# EAGLE board node5-frontend (EAGLE 5.11), part 1 of 2
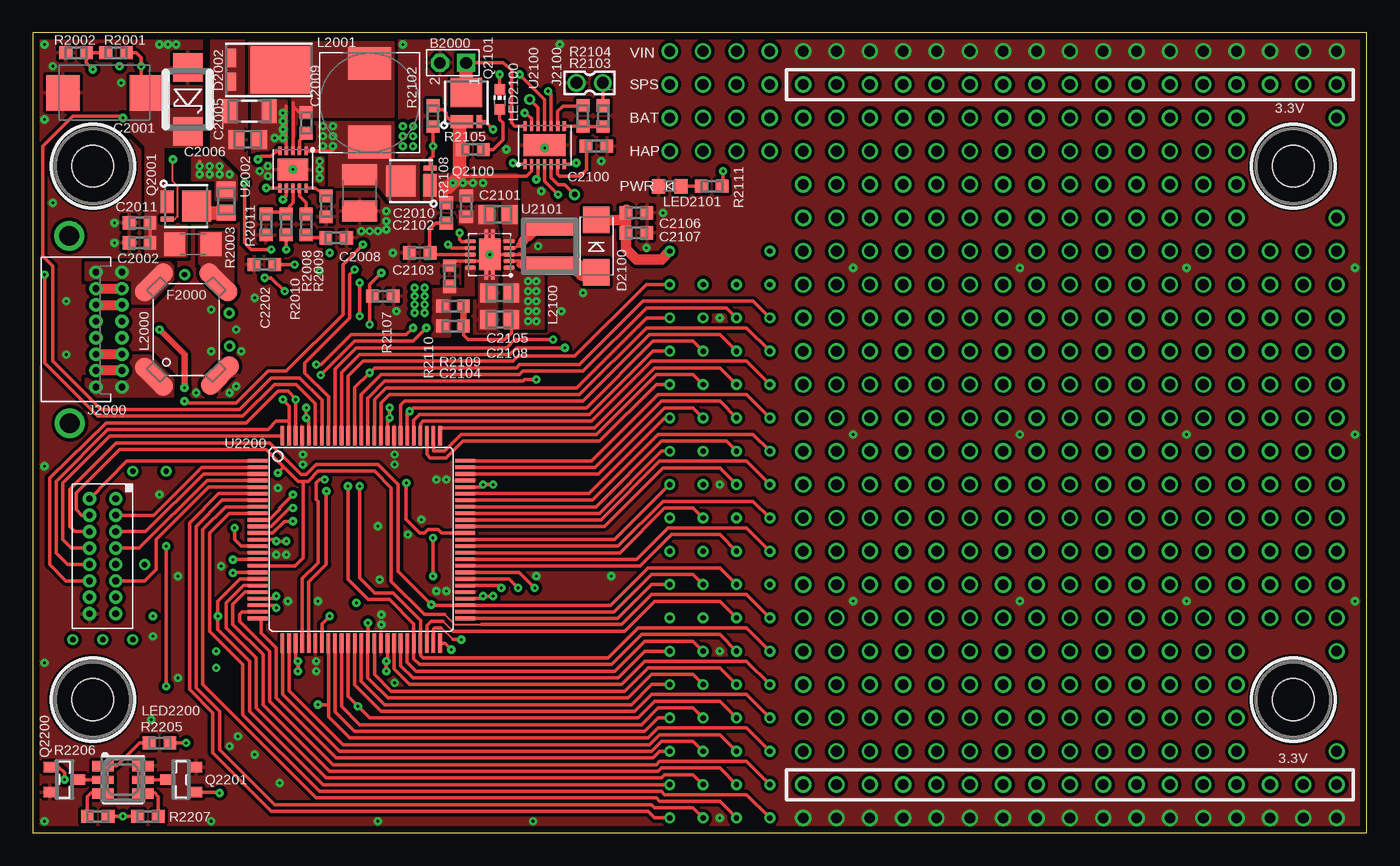
[diagram p2: board, top side]
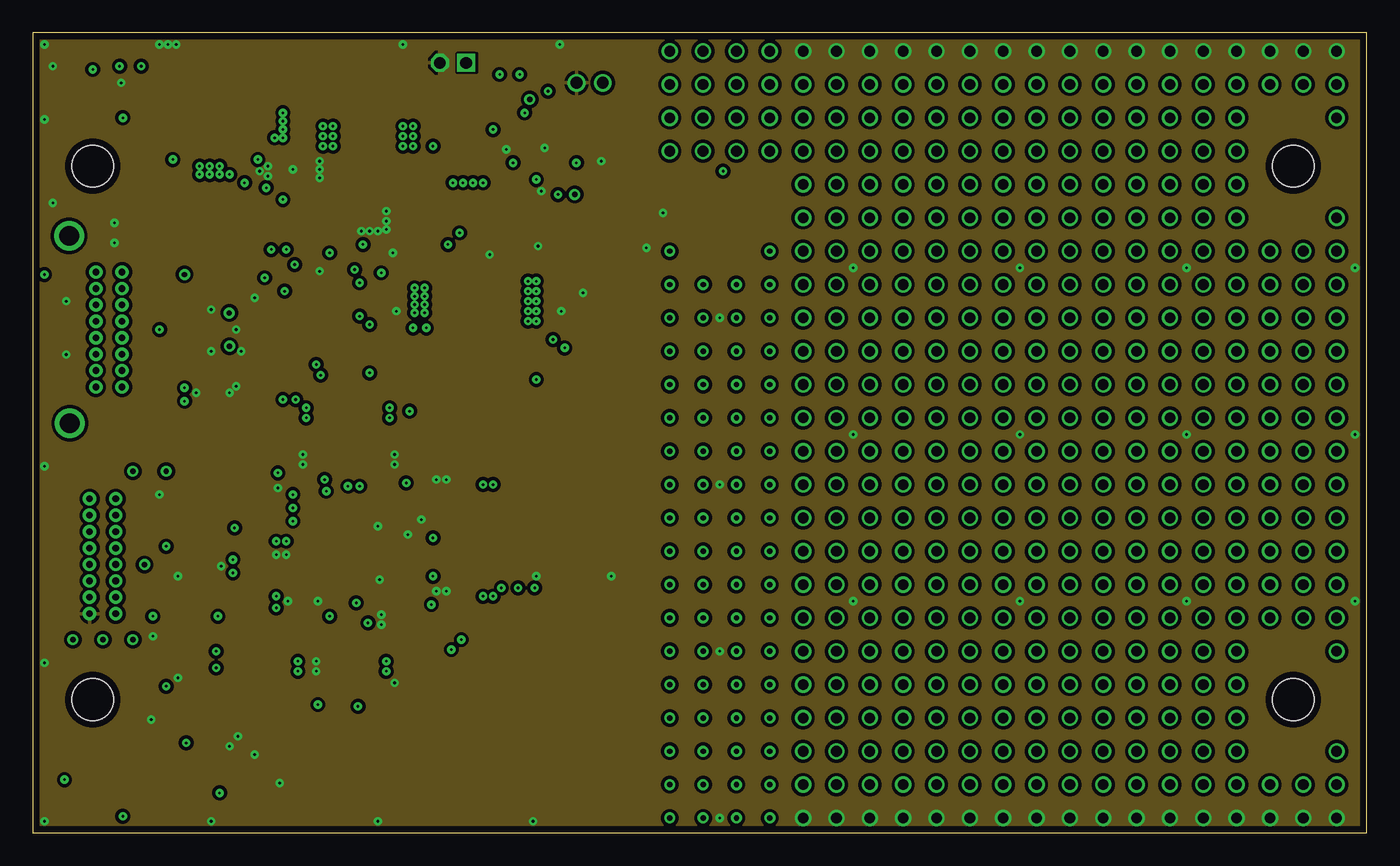
[diagram p3: board, inner layer Route2]
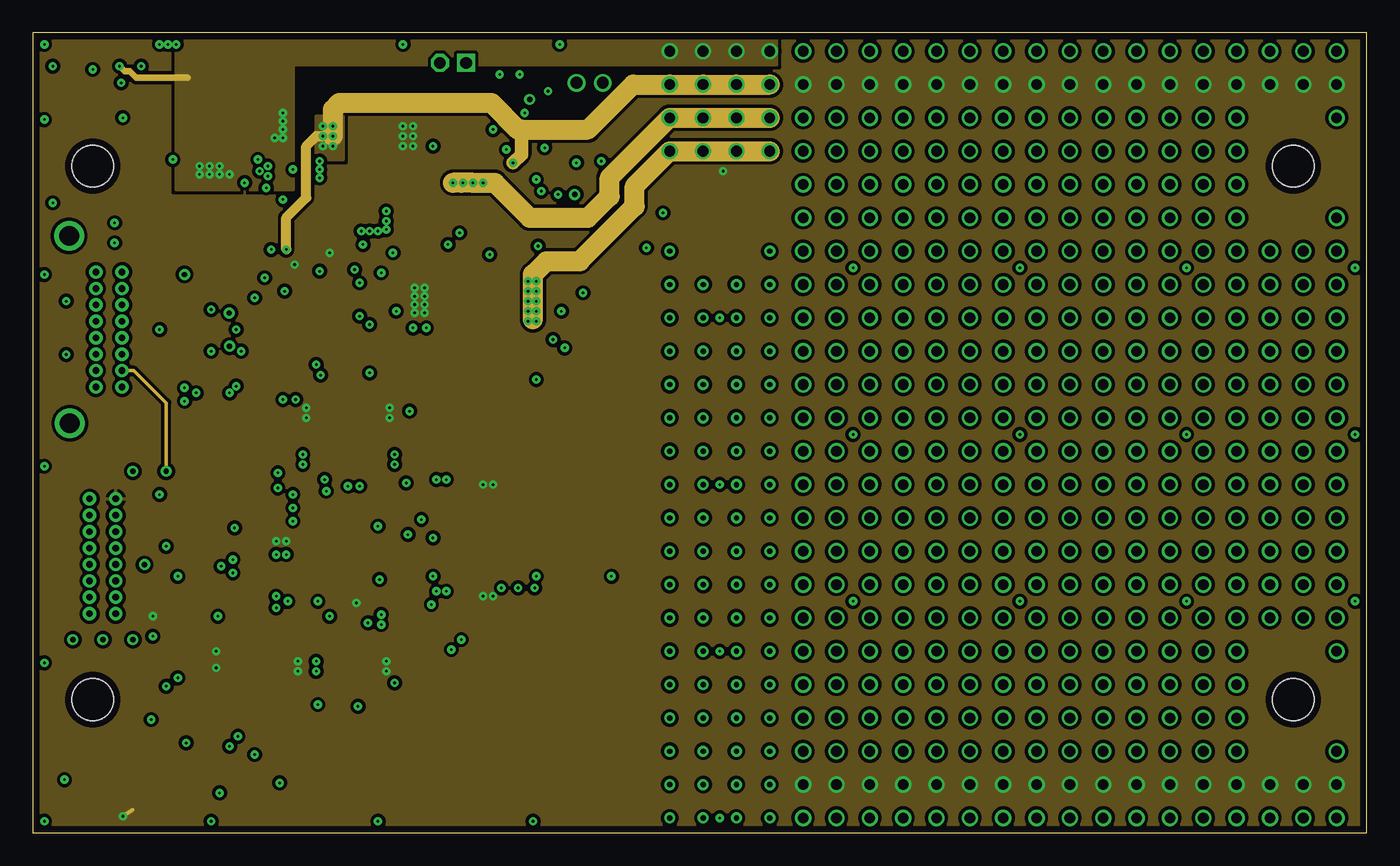
[diagram p4: board, inner layer Route15]
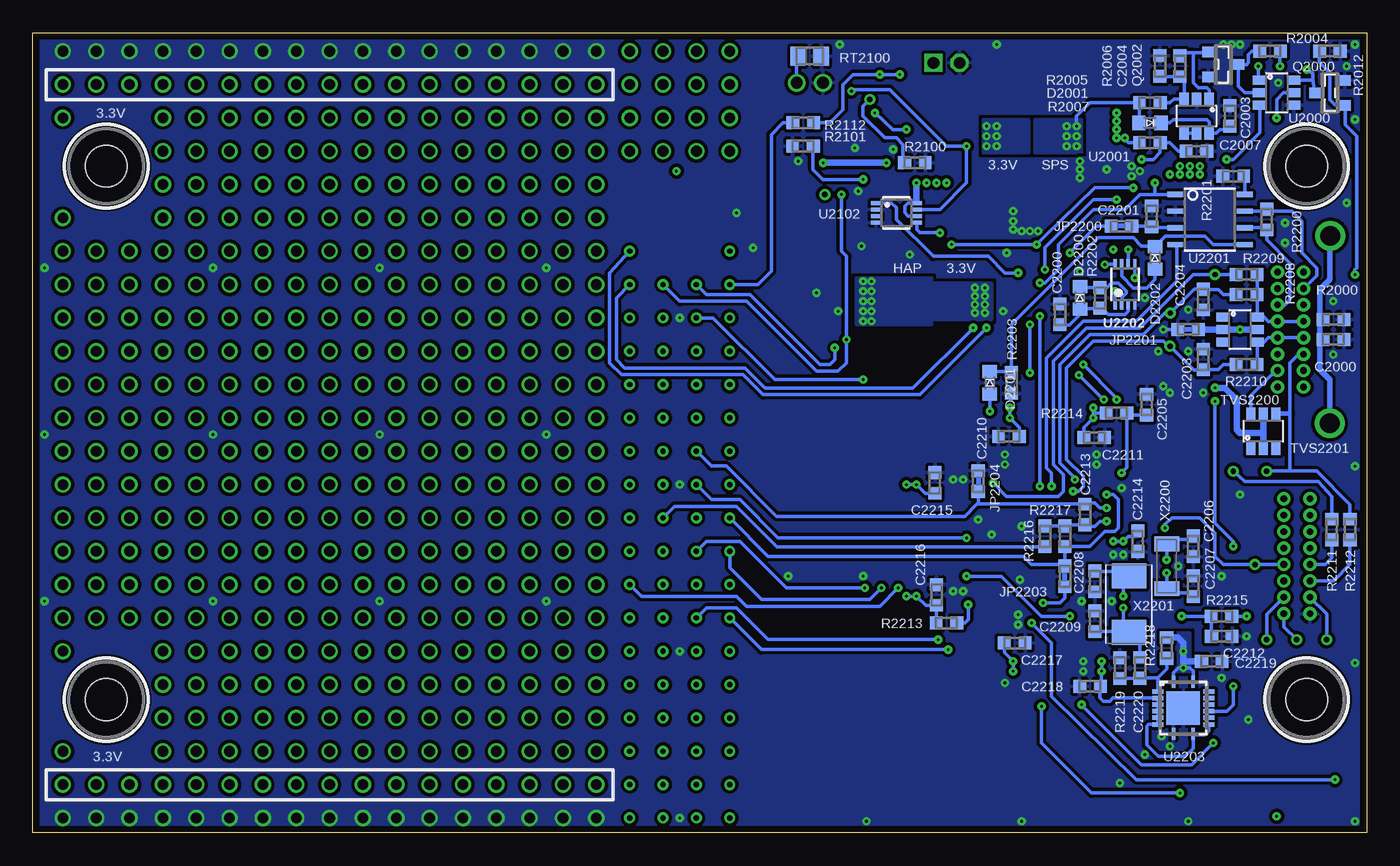
[diagram p5: board, bottom side, seen from below]

Size 101.6 x 60.96 mm. Coordinates in mm from the lower left corner, seen from the top.
Outline: 0,0 101.6,0 101.6,60.96 0,60.96 0,0
Copper layers (1+2*15+16): Top 0.0432mm / dielectric 0.3048mm / Route2 0.0356mm / dielectric 0.7112mm / Route15 0.0356mm / dielectric 0.3023mm / Bottom 0.0432mm
Design rules "sunstone_4lr_rules_v1.3_modifid *": minimum track width 6mil, minimum drill 8mil, track to track 6mil, track to pad 6mil, pad to pad 6mil, via to via 6mil, smd to smd 6mil, copper to edge 20mil, drill to drill 16mil, minimum pad ring 0.2118mm, minimum via ring 0.2118mm, stop-mask expansion 3mil, vias tented up to drill 0mil, thermal gap 10mil
tRestrict: 2 lines

## Footprints (pad centres in the part's own frame; a part is rotated, then mirrored left to right if it is on the bottom)
2MM-1X2-HEADER = drill 0.889 pad 1.372 square: 1 0,-1 | drill 0.889 pad 1.372 octagon: 2 0,1
0603-B-NOSILK = smd 0.95 x 1: 1 -0.8,0; 2 0.8,0
D/7343-31R = smd 2.55 x 2.7: + 3.175,0; - -3.175,0
1206-B = smd 1.15 x 1.8: 1 -1.5,0; 2 1.5,0
0805-B-NOSILK = smd 1.15 x 1.45: 1 -0.9,0; 2 0.9,0
C1210 = smd 1.6 x 2.7: 1 -1.4,0; 2 1.4,0
0603-DIODE = smd 1 x 1.1: A -0.85,0; K 0.85,0
D_POWERDI5 = smd 0.8 x 1.4: ANODE1 -3.47,-0.8; ANODE2 -3.47,1 | smd 4.7 x 3.6: CATHODE 0.4,0.1
NMINIP2-J1 = smd 2 x 2: A 2,0; C -2,0
1206 = smd 1.6 x 1.8: 1 -1.4,0; 2 1.4,0
#4/.250-BARE+STD_WASHER = hole 3.175: 0,0
ROCKETBUS-PLUG = drill 0.508 pad 1.016 round: AUX_1@11 2,-1.875; AUX_1@12 0,-1.875; AUX_2@13 2,-3.125; AUX_2@14 0,-3.125; B+@1 2,4.375; B+@2 0,4.375; B-@15 2,-4.375; B-@16 0,-4.375; CAN_H@3 2,3.125; CAN_H@4 0,3.125; CAN_L@5 2,1.875; CAN_L@6 0,1.875; USB_H@7 2,0.625; USB_H@8 0,0.625; USB_L@9 2,-0.625; USB_L@10 0,-0.625 | drill 1.511 round: CHASSIS@1 -2.032,7.136; CHASSIS@2 -1.982,-7.136
87758-0216 = drill 0.9 pad 1.27 round: 1 0,-1; 2 0,1
JST-16R-JED = drill 0.508 pad 1.016 round: 1 2,4.375; 2 0,4.375; 3 2,3.125; 4 0,3.125; 5 2,1.875; 6 0,1.875; 7 2,0.625; 8 0,0.625; 9 2,-0.625; 10 0,-0.625; 11 2,-1.875; 12 0,-1.875; 13 2,-3.125; 14 0,-3.125; 15 2,-4.375; 16 0,-4.375
0603-B-NO-SILK-JUMPER = smd 0.95 x 1: 1 -0.8,0; 2 0.8,0
CMS1 = smd 3.5 x 1.5 rotated 45: 1 3.608,-2.462; 3 -3.608,2.462 | smd 3.5 x 1.5 rotated 315: 2 3.508,2.562; 4 -3.608,-2.462
L-DR74 = smd 2.5 x 3.25: 1 -3,0; 2 3,0
L_NR4018 = smd 1.2 x 3.7: 1 -1.4,0; 2 1.4,0
CHIP-LED0603 = smd 0.8 x 0.8: A 0,-0.75; C 0,0.75
PLCC-6 = smd 1.65 x 0.8: 1 -1.525,1.05; 3 -1.525,-1.05; 4 1.525,-1.05; 6 1.525,1.05 | smd 1.65 x 0.6: 2 -1.525,0; 5 1.525,0
SOT23 = smd 0.787 x 0.889: 1 -0.953,-1.143; 2 0.953,-1.143; 3 0,1.143
1212-8_POWERPAK = smd 0.99 x 1.725: 1-2-3 -1.45,0.33 | smd 0.99 x 0.405: 4 -1.45,-0.99 | smd 2.24 x 2.39: 5-6-7-8 0.797,0
PAD_ROUND-APC-FREE_0.1/016 = drill 0.406 round: PAD 0,0
DO-214AA/SMB = smd 2.159 x 2.261: ANODE -2.438,0; CATHODE 2.438,0
SOT23-6 = smd 0.7 x 1: 1 -0.95,-1.3; 2 0,-1.3; 3 0.95,-1.3; 4 0.95,1.3; 5 0,1.3; 6 -0.95,1.3
DFN-10 = smd 0.25 x 0.675: BD -1,-1.413; BOOST -0.5,-1.413; FB 0,1.413; PG 0.5,1.413; RT -1,1.413; RUN/SS 1,-1.413; SW 0,-1.413; SYNC 1,1.413; VC -0.5,1.413; VIN 0.5,-1.413 | smd 2.38 x 1.65: GND 0,0
DFN-14 = smd 0.25 x 0.7: 1 -1.5,-1.45; 2 -1,-1.45; 3 -0.5,-1.45; 4 0,-1.45; 5 0.5,-1.45; 6 1,-1.45; 7 1.5,-1.45; 8 1.5,1.45; 9 1,1.45; 10 0.5,1.45; 11 0,1.45; 12 -0.5,1.45; 13 -1,1.45; 14 -1.5,1.45 | smd 3.3 x 1.7: PGND 0,0
SON-10 = smd 0.28 x 0.85: EN 1,1.475; FB -1,1.475; GND -0.5,1.475; L1 0.5,-1.475; L2 -0.5,-1.475; PGND 0,-1.475; PS/SYNC 0.5,1.475; VIN 1,-1.475; VINA 0,1.475; VOUT -1,-1.475 | smd 2.4 x 1.65: PGND@1 0,0 | smd 3.8 x 0.28: PGND@2 0,0.25; PGND@3 0,-0.25
VSSOP-8 = smd 0.3 x 0.8: 1 -0.75,-1.55; 2 -0.25,-1.55; 3 0.25,-1.55; 4 0.75,-1.55; 5 0.75,1.55; 6 0.25,1.55; 7 -0.25,1.55; 8 -0.75,1.55
LQFP100 = smd 0.28 x 1.5: #RESET 2,-7.9; #RSTOUT 0.5,-7.9; #TRST -4.5,-7.9; P0[15]/TXD1/SCK0/SCK 0.5,7.9; P0[16]/RXD1/SSEL0/SSEL 0,7.9; P0[17]/CTS1/MISO0/MISO 1,7.9; P0[18]/DCD1/MOSI0/MOSI 1.5,7.9; P0[19]/DSR1/MCICLK/SDA1 2,7.9; P0[20]/DTR1/MCICMD/SCL1 2.5,7.9; P0[21]/RI1/MCIPWR/RD1 3,7.9; P0[22]/RTS1/MCIDAT0/TD1 3.5,7.9; P0[23]/AD0[0]/I2SRX_CLK/CAP3[0] -2,-7.9; P0[24]/AD0[1]/I2SRX_WS/CAP3[1] -2.5,-7.9; P0[25]/AD0[2]/I2SRX_SDA/TXD3 -3,-7.9; P0[26]/AD0[3]/AOUT/RXD3 -3.5,-7.9; P0[27]/SDA0 6,-7.9; P0[28]/SCL0 5.5,-7.9; P1[30]/VBUS/AD0[4] 4,-7.9; P1[31]/SCK1/AD0[5] 3.5,-7.9; P2[0]/PWM1[1]/TXD1/TRACECLK -6,7.9; P2[1]/PWM1[2]/RXD1/PIPESTAT0 -5.5,7.9; P2[2]/PWM1[3]/CTS1/PIPESTAT1 -5,7.9; P2[3]/PWM1[4]/DCD1/PIPESTAT2 -3.5,7.9; P2[4]/PWM1[5]/DSR1/TRACESYNC -3,7.9; P2[5]/PWM1[6]/DTR1/TRACEPKT0 -2.5,7.9; P2[6]/PCAP1[0]/RI1/TRACEPKT1 -2,7.9; P2[7]/RD2/RTS1/TRACEPKT2 -1.5,7.9; P2[8]/TD2/TXD2/TRACEPKT3 -1,7.9; P2[9]/USB_CONNECT/RXD2/EXTIN0 -0.5,7.9; P2[10]/#EINT0 5,7.9; P2[11]/#EINT1/MCIDAT1/I2STX_CLK 5.5,7.9; P2[12]/#EINT2/MCIDAT2/I2STX_WS 6,7.9; RTCX1 1.5,-7.9; RTCX2 2.5,-7.9; TCK -4,-7.9; TDI -5.5,-7.9; TDO -6,-7.9; TMS -5,-7.9; VBAT 3,-7.9; VDD(3V3)@1 4.5,7.9; VDD(3V3)@2 -4,7.9; VDD(DCDC)(3V3) 0,-7.9; VDDA -1.5,-7.9; VREF -0.5,-7.9; VSS 1,-7.9; VSS@3 4,7.9; VSS@4 -4.5,7.9; VSSA -1,-7.9; XTAL1 4.5,-7.9; XTAL2 5,-7.9 | smd 1.5 x 0.28: P0[0]/RD1/TXD3/SDA1 7.9,4; P0[1]/TD1/RXD3/SCL1 7.9,4.5; P0[2]/TXD0 -7.9,-5; P0[3]/RXD0 -7.9,-5.5; P0[4]/I2SRX_CLK/RD2/CAP2[0] -7.9,3.5; P0[5]/I2SRX_WS/TD2/CAP2[1] -7.9,4; P0[6]/I2SRX_SDA/SSEL1/MAT2[0] -7.9,4.5; P0[7]/I2STX_CLK/SCK1/MAT2[1] -7.9,5; P0[8]/I2STX_WS/MISO1/MAT2[2] -7.9,5.5; P0[9]/I2STX_SDA/MOSI1/MAT2[3] -7.9,6; P0[10]/TXD2/SDA2/MAT3[0] 7.9,5; P0[11]/RXD2/SCL2/MAT3[1] 7.9,5.5; P0[29]/USB_D+ 7.9,-4.5; P0[30]/USB_D- 7.9,-4; P1[0]/ENET_TXD0 -7.9,-3.5; P1[1]/ENET_TXD1 -7.9,-3; P1[4]/ENET_TX_EN -7.9,-2.5; P1[8]/ENET_CRS -7.9,-2; P1[9]/ENET_RXD0 -7.9,-1.5; P1[10]/ENET_RXD1 -7.9,-1; P1[14]/ENET_RX_ER -7.9,-0.5; P1[15]/ENET_REF_CLK -7.9,0; P1[16]/ENET_MDC -7.9,0.5; P1[17]/ENET_MDIO -7.9,1; P1[18]/USB_UP_LED/PWM1[1]/CAP1[0] 7.9,-3; P1[19]/CAP1[1] 7.9,-2.5; P1[20]/PWM1[2]/SCK0 7.9,-2; P1[21]/PWM1[3]/SSEL0 7.9,-1.5; P1[22]MAT1[0] 7.9,-1; P1[23]/PWM1[4]/MISO0 7.9,-0.5; P1[24]/PWM1[5]/MOSI0 7.9,0; P1[25]/MAT1[1] 7.9,0.5; P1[26]/PWM1[6]/CAP0[0] 7.9,1; P1[27]/CAP0[1] 7.9,2.5; P1[28]/PCAP1[0]/MAT0[0] 7.9,3; P1[29]/PCAP1[1]/MAT0[1] 7.9,3.5; P2[13]/#EINT3/MCIDAT3/I2STX_SDA 7.9,6; P3[25]/MAT0[0]/PWM1[2] 7.9,-5.5; P3[26]/MAT0[1]/PWM1[3] 7.9,-6; P4[28]/MAT2[0]/TXD3 -7.9,3; P4[29]/MAT2[1]/RXD3 -7.9,1.5; RTCK -7.9,-6; VDD(3V3) 7.9,-5; VDD(3V3)@3 -7.9,-4; VDD(DCDC)(3V3)@1 7.9,2; VDD(DCDC)(3V3)@2 -7.9,2; VSS@1 7.9,-3.5; VSS@2 7.9,1.5; VSS@5 -7.9,-4.5; VSS@6 -7.9,2.5
DR-PDSO-G8 = smd 0.4 x 1.2: 1 -1.905,-2.65; 2 -0.635,-2.65; 3 0.635,-2.65; 4 1.905,-2.65; 5 1.905,2.65; 6 0.635,2.65; 7 -0.635,2.65; 8 -1.905,2.65
DCU = smd 0.25 x 0.75: 1 -0.75,-1.55; 2 -0.25,-1.55; 3 0.25,-1.55; 4 0.75,-1.55; 5 0.75,1.55; 6 0.25,1.55; 7 -0.25,1.55; 8 -0.75,1.55
QFN-16 = smd 0.85 x 0.28: 1 -1.97,-0.75; 8 1.97,-0.74; 9 1.97,0.75; 16 -1.98,0.75 | smd 0.28 x 0.85: 2 -1.25,-1.95; 3 -0.75,-1.95; 4 -0.25,-1.95; 5 0.25,-1.95; 6 0.75,-1.95; 7 1.25,-1.95; 10 1.25,1.95; 11 0.75,1.95; 12 0.25,1.95; 13 -0.25,1.95; 14 -0.75,1.95; 15 -1.25,1.95 | smd 2.55 x 2.55: PGND 0,0
CM415 = smd 1.118 x 1.905: P$1 -1.702,0; P$2 1.702,0
CS10 = smd 1.9 x 2.6: P$1 -2.15,0; P$2 2.15,0

## Placement (x,y rotation side)
B2100  BATTERY_SINGLE_CELL_2MM  [2MM-1X2-HEADER]  32,58.67 90 top
C2000  100n 50V  [0603-B-NOSILK]  2.54,37.59 0 bottom
C2001  22u 50V  [D/7343-31R]  5.46,56.39 0 top
C2002  330n 50V  [0603-B-NOSILK]  8.13,44.96 0 top
C2003  2.7u  [0603-B-NOSILK]  10.41,54.61 270 bottom
C2004  15n  [0603-B-NOSILK]  14.22,58.42 90 bottom
C2005  10u 50V  [1206-B]  16.51,54.99 180 top
C2006  1u 50V  [0805-B-NOSILK]  16.38,52.83 180 top
C2007  100n  [0603-B-NOSILK]  12.95,51.94 180 bottom
C2008  680p  [0603-B-NOSILK]  23.11,45.34 180 top
C2009  220n  [0603-B-NOSILK]  20.83,54.1 90 top
C2010  22u  [C1210]  24.89,48.77 270 top
C2011  10n 50V  [0603-B-NOSILK]  8.13,46.48 0 top
C2100  66n  [0603-B-NOSILK]  42.93,52.32 180 top
C2101  10u  [0805-B-NOSILK]  35.43,47.12 0 top
C2102  100n  [0603-B-NOSILK]  33.02,47.75 90 top
C2103  100n  [0603-B-NOSILK]  29.46,44.2 0 top
C2104  2pF  [0603-B-NOSILK]  32,38.61 0 top
C2105  10u  [0805-B-NOSILK]  35.56,41.15 0 top
C2106  TBD  [0603-B-NOSILK]  45.97,47.24 180 top
C2107  TBD  [0603-B-NOSILK]  45.97,45.72 180 top
C2108  10u  [0805-B-NOSILK]  35.56,39.12 0 top
C2200  10n  [0603-B-NOSILK]  23.37,39.5 270 bottom
C2201  100n  [0603-B-NOSILK]  16.38,46.99 90 bottom
C2202  100n  [0603-B-NOSILK]  17.65,43.31 180 top
C2203  18p  [0603-B-NOSILK]  12.45,36.07 270 bottom
C2204  18p  [0603-B-NOSILK]  12.45,40.64 90 bottom
C2205  100n  [0603-B-NOSILK]  16.76,32.64 90 bottom
C2206  22p  [0603-B-NOSILK]  13.21,21.84 90 bottom
C2207  22p  [0603-B-NOSILK]  13.21,18.8 270 bottom
C2208  39p  [0603-B-NOSILK]  20.7,19.18 90 bottom
C2209  33p  [0603-B-NOSILK]  20.7,16.13 270 bottom
C2210  100n  [0603-B-NOSILK]  27.24,30.21 180 bottom
C2211  100n  [0603-B-NOSILK]  20.76,30.12 0 bottom
C2212  100n  [0603-B-NOSILK]  11.05,14.99 0 bottom
C2213  100n  [0603-B-NOSILK]  21.46,24.26 270 bottom
C2214  100n  [0603-B-NOSILK]  17.43,22.23 270 bottom
C2215  100n  [0603-B-NOSILK]  32.89,26.67 90 bottom
C2216  100n  [0603-B-NOSILK]  32.77,18.14 90 bottom
C2217  100n  [0603-B-NOSILK]  26.8,14.48 180 bottom
C2218  100n  [0603-B-NOSILK]  21.08,11.18 0 bottom
C2219  100n  [0603-B-NOSILK]  11.81,13.08 0 bottom
C2220  100p  [0603-B-NOSILK]  17.27,12.57 270 bottom
D2001  CDSU101A  [0603-DIODE]  16.51,54.1 0 bottom
D2002  PDS340  [D_POWERDI5]  18.54,58.04 0 top
D2100  MA2Q705  [NMINIP2-J1]  42.93,44.7 270 top
D2200  CDSU101A  [0603-DIODE]  21.84,40.77 90 bottom
D2201  CDSU101A  [0603-DIODE]  28.7,34.29 90 bottom
D2202  CDSU101A  [0603-DIODE]  16.13,43.81 90 bottom
F2000  2.0A Fast  [1206]  12.19,44.83 180 top
FST2000  #4-BARE_MOUNTING_HOLE/.250  [#4/.250-BARE+STD_WASHER]  4.57,50.8 0 top
FT2001  #4-BARE_MOUNTING_HOLE/.250  [#4/.250-BARE+STD_WASHER]  4.57,10.16 0 top
FT2002  #4-BARE_MOUNTING_HOLE/.250  [#4/.250-BARE+STD_WASHER]  96.01,10.16 0 top
FT2003  #4-BARE_MOUNTING_HOLE/.250  [#4/.250-BARE+STD_WASHER]  96.01,50.8 0 top
J2000  ROCKETBUS-PLUG  [ROCKETBUS-PLUG]  4.8,38.35 0 top
J2100  87758-0216  [87758-0216]  42.42,57.15 90 top
J2204  DEBUG-CONNECTOR  [JST-16R-JED]  4.32,21.08 0 top
JP2200  0603-B-NO-SILK-CUT-JUMPER  [0603-B-NO-SILK-JUMPER]  18.67,46.23 180 bottom
JP2201  0603-B-NO-SILK-CUT-JUMPER  [0603-B-NO-SILK-JUMPER]  13.59,38.35 180 bottom
JP2203  0603-B-NO-SILK-CUT-JUMPER  [0603-B-NO-SILK-JUMPER]  22.99,19.56 90 bottom
JP2204  0603-B-NO-SILK-CUT-JUMPER  [0603-B-NO-SILK-JUMPER]  29.59,26.8 270 bottom
L2000  CMS1  [CMS1]  11.68,38.35 270 top
L2001  L_DR74-6R8-R  [L-DR74]  25.65,55.63 270 top
L2100  2.2 uH L_NR4018T2R2M  [L_NR4018]  39.37,44.7 270 top
LED2100  RED  [CHIP-LED0603]  35.56,55.88 0 top
LED2101  LED-GRN-  [0603-DIODE]  48.51,49.28 180 top
LED2200  [PLCC-6]  6.86,4.06 0 top
Q2000  PMV45EN  [SOT23]  2.79,56.39 90 bottom
Q2001  Si7309DN  [1212-8_POWERPAK]  11.68,47.75 0 top
Q2002  PMV45EN  [SOT23]  10.92,58.55 270 bottom
Q2100  SI7123DN  [1212-8_POWERPAK]  28.83,49.66 180 top
Q2101  SI7123DN  [1212-8_POWERPAK]  33.02,55.63 90 top
Q2200  PMV45EN  [SOT23]  2.41,4.06 270 top
Q2201  PMV45EN  [SOT23]  11.3,4.06 90 top
R2000  100k  [0603-B-NOSILK]  2.54,39.12 0 bottom
R2001  61.9k  [0603-B-NOSILK]  6.35,59.44 0 top
R2002  10k  [0603-B-NOSILK]  3.3,59.44 0 top
R2003  .033  [0805-B-NOSILK]  14.73,48.13 90 top
R2004  1k  [0603-B-NOSILK]  7.37,59.56 0 bottom
R2005  34.0k 1%  [0603-B-NOSILK]  16.51,55.63 180 bottom
R2006  10k 1%  [0603-B-NOSILK]  15.75,58.42 270 bottom
R2007  500k  [0603-B-NOSILK]  16.51,52.58 180 bottom
R2008  15k  [0603-B-NOSILK]  20.83,46.35 90 top
R2009  26.7k  [0603-B-NOSILK]  22.35,47.75 90 top
R2010  532k  [0603-B-NOSILK]  19.3,46.35 270 top
R2011  100k  [0603-B-NOSILK]  17.78,46.35 90 top
R2012  10k  [0603-B-NOSILK]  2.79,59.56 180 bottom
R2100  100k  [0603-B-NOSILK]  34.42,51.05 0 bottom
R2101  660  [0603-B-NOSILK]  42.93,52.32 180 bottom
R2102  1k  [0603-B-NOSILK]  30.48,54.61 90 top
R2103  121k 1%  [0603-B-NOSILK]  41.91,54.61 270 top
R2104  15k 1%  [0603-B-NOSILK]  43.43,54.61 90 top
R2105  1.6k  [0603-B-NOSILK]  33.53,52.07 0 top
R2107  1k  [0603-B-NOSILK]  26.67,40.89 180 top
R2108  100  [0603-B-NOSILK]  31.5,47.24 90 top
R2109  1.0M  [0603-B-NOSILK]  32,40.13 0 top
R2110  178k  [0603-B-NOSILK]  31.75,42.42 270 top
R2111  1k  [0603-B-NOSILK]  51.71,49.28 0 top
R2112  10k  [0603-B-NOSILK]  42.93,54.1 0 bottom
R2200  NP  [0603-B-NOSILK]  7.62,46.74 90 bottom
R2201  18k  [0603-B-NOSILK]  10.16,50.04 0 bottom
R2202  10k  [0603-B-NOSILK]  20.32,40.77 90 bottom
R2203  10k  [0603-B-NOSILK]  27.05,34.29 90 bottom
R2205  1k  [0603-B-NOSILK]  9.65,6.86 0 top
R2206  1k  [0603-B-NOSILK]  4.95,1.27 180 top
R2207  1k  [0603-B-NOSILK]  8.76,1.27 0 top
R2208  1.5k  [0603-B-NOSILK]  9.14,42.55 180 bottom
R2209  33.2  [0603-B-NOSILK]  9.14,41.02 180 bottom
R2210  33.2  [0603-B-NOSILK]  9.14,35.69 180 bottom
R2211  100  [0603-B-NOSILK]  2.67,23.11 270 bottom
R2212  100  [0603-B-NOSILK]  1.27,23.11 270 bottom
R2213  10k  [0603-B-NOSILK]  32,16 180 bottom
R2214  10k  [0603-B-NOSILK]  19.05,32 180 bottom
R2215  0  [0603-B-NOSILK]  11.05,16.51 180 bottom
R2216  0  [0603-B-NOSILK]  24.51,22.61 90 bottom
R2217  0  [0603-B-NOSILK]  22.99,22.61 90 bottom
R2218  100k  [0603-B-NOSILK]  15.24,14.1 270 bottom
R2219  100k  [0603-B-NOSILK]  18.8,12.57 90 bottom
RT2100  100k @25C  [0805-B-NOSILK]  42.42,59.18 0 bottom
TP0.0  PAD_ROUND016  [PAD_ROUND-APC-FREE_0.1/016]  53.59,13.84 90 top
TP0.1  PAD_ROUND016  [PAD_ROUND-APC-FREE_0.1/016]  56.13,13.84 90 top
TP0.2  PAD_ROUND016  [PAD_ROUND-APC-FREE_0.1/016]  56.13,41.78 180 top
TP0.3  PAD_ROUND016  [PAD_ROUND-APC-FREE_0.1/016]  56.13,44.32 180 top
TP0.4  PAD_ROUND016  [PAD_ROUND-APC-FREE_0.1/016]  51.05,36.7 270 top
TP0.5  PAD_ROUND016  [PAD_ROUND-APC-FREE_0.1/016]  48.51,36.7 270 top
TP0.6  PAD_ROUND016  [PAD_ROUND-APC-FREE_0.1/016]  56.13,34.16 270 top
TP0.7  PAD_ROUND016  [PAD_ROUND-APC-FREE_0.1/016]  48.51,34.16 270 top
TP0.8  PAD_ROUND016  [PAD_ROUND-APC-FREE_0.1/016]  51.05,34.16 270 top
TP0.9  PAD_ROUND016  [PAD_ROUND-APC-FREE_0.1/016]  53.59,34.16 270 top
TP0.10  PAD_ROUND016  [PAD_ROUND-APC-FREE_0.1/016]  53.59,16.38 90 top
TP0.11  PAD_ROUND016  [PAD_ROUND-APC-FREE_0.1/016]  51.05,16.38 90 top
TP0.12  PAD_ROUND016  [PAD_ROUND-APC-FREE_0.1/016]  37.85,55.88 0 top
TP0.15  PAD_ROUND016  [PAD_ROUND-APC-FREE_0.1/016]  56.13,24 270 top
TP0.16  PAD_ROUND016  [PAD_ROUND-APC-FREE_0.1/016]  48.51,26.54 270 top
TP0.17  PAD_ROUND016  [PAD_ROUND-APC-FREE_0.1/016]  51.05,24 270 top
TP0.18  PAD_ROUND016  [PAD_ROUND-APC-FREE_0.1/016]  56.13,21.46 270 top
TP0.19  PAD_ROUND016  [PAD_ROUND-APC-FREE_0.1/016]  53.59,21.46 270 top
TP0.20  PAD_ROUND016  [PAD_ROUND-APC-FREE_0.1/016]  51.05,21.46 270 top
TP0.21  PAD_ROUND016  [PAD_ROUND-APC-FREE_0.1/016]  48.51,21.46 270 top
TP0.22  PAD_ROUND016  [PAD_ROUND-APC-FREE_0.1/016]  56.13,18.92 270 top
TP0.23  PAD_ROUND016  [PAD_ROUND-APC-FREE_0.1/016]  56.13,1.14 90 top
TP0.24  PAD_ROUND016  [PAD_ROUND-APC-FREE_0.1/016]  53.59,1.14 270 top
TP0.25  PAD_ROUND016  [PAD_ROUND-APC-FREE_0.1/016]  51.05,1.14 180 top
TP0.26  PAD_ROUND016  [PAD_ROUND-APC-FREE_0.1/016]  48.51,1.14 90 top
TP0.27  PAD_ROUND016  [PAD_ROUND-APC-FREE_0.1/016]  48.51,6.22 180 top
TP0.28  PAD_ROUND016  [PAD_ROUND-APC-FREE_0.1/016]  56.13,3.68 180 top
TP0.29  PAD_ROUND016  [PAD_ROUND-APC-FREE_0.1/016]  14.96,39.61 90 top
TP0.30  PAD_ROUND016  [PAD_ROUND-APC-FREE_0.1/016]  14.99,37.08 90 top
TP1.1  PAD_ROUND016  [PAD_ROUND-APC-FREE_0.1/016]  41.27,48.64 0 top
TP1.8  PAD_ROUND016  [PAD_ROUND-APC-FREE_0.1/016]  53.59,41.78 270 top
TP1.9  PAD_ROUND016  [PAD_ROUND-APC-FREE_0.1/016]  51.05,41.78 270 top
TP1.10  PAD_ROUND016  [PAD_ROUND-APC-FREE_0.1/016]  48.51,41.78 270 top
TP1.14  PAD_ROUND016  [PAD_ROUND-APC-FREE_0.1/016]  56.13,39.24 90 top
TP1.15  PAD_ROUND016  [PAD_ROUND-APC-FREE_0.1/016]  53.59,39.24 90 top
TP1.16  PAD_ROUND016  [PAD_ROUND-APC-FREE_0.1/016]  51.05,39.24 90 top
TP1.17  PAD_ROUND016  [PAD_ROUND-APC-FREE_0.1/016]  48.51,39.24 270 top
TP1.18  PAD_ROUND016  [PAD_ROUND-APC-FREE_0.1/016]  51.05,26.54 90 top
TP1.19  PAD_ROUND016  [PAD_ROUND-APC-FREE_0.1/016]  56.13,6.22 90 top
TP1.20  PAD_ROUND016  [PAD_ROUND-APC-FREE_0.1/016]  48.51,8.76 90 top
TP1.21  PAD_ROUND016  [PAD_ROUND-APC-FREE_0.1/016]  51.05,8.76 90 top
TP1.22  PAD_ROUND016  [PAD_ROUND-APC-FREE_0.1/016]  53.59,8.76 270 top
TP1.23  PAD_ROUND016  [PAD_ROUND-APC-FREE_0.1/016]  56.13,8.76 90 top
TP1.24  PAD_ROUND016  [PAD_ROUND-APC-FREE_0.1/016]  48.51,11.3 90 top
TP1.25  PAD_ROUND016  [PAD_ROUND-APC-FREE_0.1/016]  51.05,11.3 270 top
TP1.26  PAD_ROUND016  [PAD_ROUND-APC-FREE_0.1/016]  53.59,11.3 270 top
TP1.27  PAD_ROUND016  [PAD_ROUND-APC-FREE_0.1/016]  56.13,11.3 270 top
TP1.28  PAD_ROUND016  [PAD_ROUND-APC-FREE_0.1/016]  48.51,13.84 270 top
TP1.29  PAD_ROUND016  [PAD_ROUND-APC-FREE_0.1/016]  51.05,13.84 270 top
TP1.30  PAD_ROUND016  [PAD_ROUND-APC-FREE_0.1/016]  53.59,3.68 0 top
TP1.31  PAD_ROUND016  [PAD_ROUND-APC-FREE_0.1/016]  51.05,3.68 0 top
TP2.0  PAD_ROUND016  [PAD_ROUND-APC-FREE_0.1/016]  56.13,31.62 0 top
TP2.1  PAD_ROUND016  [PAD_ROUND-APC-FREE_0.1/016]  53.59,31.62 0 top
TP2.2  PAD_ROUND016  [PAD_ROUND-APC-FREE_0.1/016]  51.05,31.62 0 top
TP2.3  PAD_ROUND016  [PAD_ROUND-APC-FREE_0.1/016]  48.51,31.62 90 top
TP2.4  PAD_ROUND016  [PAD_ROUND-APC-FREE_0.1/016]  56.13,29.08 90 top
TP2.5  PAD_ROUND016  [PAD_ROUND-APC-FREE_0.1/016]  53.59,29.08 90 top
TP2.6  PAD_ROUND016  [PAD_ROUND-APC-FREE_0.1/016]  48.51,29.08 90 top
TP2.7  PAD_ROUND016  [PAD_ROUND-APC-FREE_0.1/016]  56.13,26.54 90 top
TP2.8  PAD_ROUND016  [PAD_ROUND-APC-FREE_0.1/016]  53.59,26.54 90 top
TP2.9  PAD_ROUND016  [PAD_ROUND-APC-FREE_0.1/016]  11.56,42.55 90 top
TP2.10  PAD_ROUND016  [PAD_ROUND-APC-FREE_0.1/016]  53.59,18.92 270 top
TP2.11  PAD_ROUND016  [PAD_ROUND-APC-FREE_0.1/016]  51.05,18.92 270 top
TP2.12  PAD_ROUND016  [PAD_ROUND-APC-FREE_0.1/016]  48.51,18.92 270 top
TP2.13  PAD_ROUND016  [PAD_ROUND-APC-FREE_0.1/016]  48.51,16.38 270 top
TP3.25  PAD_ROUND016  [PAD_ROUND-APC-FREE_0.1/016]  53.59,6.22 0 top
TP3.26  PAD_ROUND016  [PAD_ROUND-APC-FREE_0.1/016]  51.05,6.22 0 top
TP4.28  PAD_ROUND016  [PAD_ROUND-APC-FREE_0.1/016]  53.59,36.7 270 top
TP4.29  PAD_ROUND016  [PAD_ROUND-APC-FREE_0.1/016]  56.13,36.7 270 top
TP-AUX1  PAD_ROUND016  [PAD_ROUND-APC-FREE_0.1/016]  7.62,27.56 0 top
TP-AUX2  PAD_ROUND016  [PAD_ROUND-APC-FREE_0.1/016]  10.16,27.56 0 top
TP-AVCC  PAD_ROUND016  [PAD_ROUND-APC-FREE_0.1/016]  48.51,24 270 top
TP-DBG13  PAD_ROUND016  [PAD_ROUND-APC-FREE_0.1/016]  7.62,14.73 270 top
TP-DBG14  PAD_ROUND016  [PAD_ROUND-APC-FREE_0.1/016]  3.05,14.73 180 top
TP-DBG15  PAD_ROUND016  [PAD_ROUND-APC-FREE_0.1/016]  5.33,14.73 180 top
TP-HAP-5V  t24  [PAD_ROUND-APC-FREE_0.1/016]  48.51,44.32 270 top
TP-NRST  PAD_ROUND016  [PAD_ROUND-APC-FREE_0.1/016]  56.13,16.38 90 top
TP-NRST0UT  PAD_ROUND016  [PAD_ROUND-APC-FREE_0.1/016]  8.51,20.45 180 top
TP-VBAT  t24  [PAD_ROUND-APC-FREE_0.1/016]  48.51,3.68 0 top
TP-VREF  t24  [PAD_ROUND-APC-FREE_0.1/016]  53.59,24 90 top
TP-VREF-GND  t24  [PAD_ROUND-APC-FREE_0.1/016]  51.05,29.08 90 top
TVS2000  TVS_SMB  [DO-214AA/SMB]  11.81,55.88 270 top
TVS2200  SN65220DBVR  [SOT23-6]  9.65,38.35 270 bottom
TVS2201  SN65220DBVR  [SOT23-6]  7.87,30.61 0 bottom
U2000  MAX5902AAEUT  [SOT23-6]  6.86,56.39 270 bottom
U2001  TLV3012AIDBVT  [SOT23-6]  12.95,54.61 180 bottom
U2002  IC_LT3972  [DFN-10]  19.81,50.55 180 top
U2100  IC_LTC4085  [DFN-14]  38.99,52.4 0 top
U2101  IC_TPS63000  [SON-10]  34.8,44.07 90 top
U2102  [VSSOP-8]  35.81,47.24 270 bottom
U2200  IC_LPC2368  [LQFP100]  25.02,22.35 270 top
U2201  IC_SN65HVD235  [DR-PDSO-G8]  11.94,46.74 270 bottom
U2202  74LVC3G14DCU  [DCU]  18.41,41.78 0 bottom
U2203  IC_SN74LV163A  [QFN-16]  13.97,9.53 270 bottom
X2200  32.768 kHz  [CM415]  15.24,20.32 90 bottom
X2201  12.0 MHz  [CS10]  18.1,17.43 270 bottom

## Tracks (layer width: path | path; a pad name or v marks a point on that pad's centre or on a via)
3.3V  (via drill 0.2, 0.81)
  Top 0.254: U2200.VDD(3V3)@1 34.23,17.85 v34.29,18.03 v35.05,18.03 | U2200.VDD(3V3)@3 21.02,31.56 v20.83,31.62 v20.83,32.38 | U2200.VDD(DCDC)(3V3)@2 27.02,31.46 v27.18,31.62 v27.18,32.38 | U2200.VDD(DCDC)(3V3) 18.41,22.35 v18.54,22.23 v19.3,22.23 | U2200.VDD(3V3) 20.02,13.26 v20.19,13.08 v20.19,12.32 | U2200.VDD(DCDC)(3V3)@1 27.02,13.18 v26.92,13.08 v26.92,12.32 | U2200.VDD(3V3)@2 34.23,26.35 v34.29,26.54 v35.05,26.54 | R2111.2 52.58,49.28 v52.58,50.42 | R2207.1 v6.86,1.27 R2206.1 | v19.94,43.31 C2202.1
  Route15 0.254: v6.86,1.27 7.62,1.78
  Bottom 0.254: v35.05,18.03 v34.29,18.03 33.59,17.34 C2216.1 32.77,16.04 R2213.2 | C2211.1 21.56,30.89 v20.83,31.62 20.83,32 | 20.83,32 v20.83,32.38 | R2214.2 20.83,32 | C2210.1 26.44,30.89 v27.18,31.62 v27.18,32.38 | C2215.1 33.62,25.87 v34.29,26.54 v35.05,26.54 | C2217.2 27.6,13.75 v26.92,13.08 v26.92,12.32 | v19.3,22.23 v18.54,22.23 18.16,22.61 17.47,22.61 C2214.1 | U2203.10 12.02,7.79 12.32,7.49 13.16,7.49 U2203.9 13.22,6.46 13.84,5.84 15.88,5.84 16.76,6.73 16.76,8.13 16.62,8.28 U2203.7 U2203.6 U2203.5 U2203.4 U2203.3 19.32,10.28 19.56,10.03 20.07,10.03 20.32,10.29 20.32,11.14 C2218.2 20.19,11.27 v20.19,12.32 20.16,12.36 20.16,13.04 | v9.14,16.51 R2215.1 | v24.64,17.53 23.37,17.53 22.99,17.91 JP2203.1 | JP2200.2 20.57,46.23 v22.61,44.2 | U2202.8 19.91,43.33 v19.94,43.31 | U2203.1 14.72,12.2 14.35,12.57 v13.97,12.57 13.46,12.57 13.22,12.33 U2203.16
  Bottom 0.508: R2218.1 14.39,14.9 13.97,14.48 v13.97,13.84 13.97,13.08 | C2219.1 13.97,13.08 | 13.97,13.08 v13.97,12.57
  other vias: 78.99,57.02 81.53,57.02 84.07,57.02 86.61,57.02 89.15,57.02 91.69,57.02 96.77,57.02 99.31,57.02 28.19,52.32 28.96,52.32 28.96,53.09 28.19,53.09 28.19,53.85 28.96,53.85 29.84,40.89 29.84,40.26 29.84,39.62 29.08,39.62 29.08,40.26 29.08,40.89 58.67,57.02 61.21,57.02 63.75,57.02 66.29,57.02 68.83,57.02 71.37,57.02 73.91,57.02 76.45,57.02 94.23,57.02 58.67,3.68 61.21,3.68 63.75,3.68 66.29,3.68 68.83,3.68 71.37,3.68 73.91,3.68 76.45,3.68 78.99,3.68 81.53,3.68 84.07,3.68 86.61,3.68 89.15,3.68 91.69,3.68 94.23,3.68 96.77,3.68 99.31,3.68 29.84,41.53 29.08,41.53
  pour Route15 (isolate 0.254, rank 4): 0,60.96 101.6,60.96 101.6,0 0,0
  pour Bottom (rank 2): 29.21,54.36 29.21,51.82 25.78,51.82 25.78,54.36
  pour Bottom (isolate 0.254, rank 2): 28.57,41.91 28.57,39.12 33.15,39.12 33.15,41.91
  pour Bottom (isolate 0.254): 14.48,12.32 14.48,14.61 15.62,14.61 15.62,15.24 13.46,15.24 13.46,13.46 12.95,13.46 12.95,12.32
!RESET!  (via drill 0.2)
  Top 0.152: 31.37,16.64 32.13,15.88 34.16,15.88
  Top 0.254: U2200.#RESET 19.97,20.35 20.57,20.95 20.57,26.8 | 31.37,16.64 29.84,16.64 27.3,19.18 27.3,26.29 26.04,27.56 21.72,27.56 20.95,26.8 20.57,26.8 | 20.57,26.8 20.19,26.8 19.11,27.88 | 19.11,27.88 17.78,29.21 6.6,29.21 3.3,25.91 3.3,24.64 3.73,24.21 J2204.4 | 19.11,27.88 v18.67,27.43 | 34.16,15.88 44.83,15.88 47.12,18.16 54.36,18.16 TP-NRST.PAD
  Bottom 0.254: C2205.1 18.09,31.84 R2214.1 18.25,27.85 v18.67,27.43
!RSTOUT!  (via drill 0.2)
  Top 0.254: U2200.#RSTOUT 15.87,21.85 15.37,22.35 v15.37,23.24
  Bottom 0.254: v15.37,23.24 15.37,23.5 14.86,24 12.7,24 11.56,22.86 11.56,21.08 10.92,20.45 TP-NRST0UT.PAD 7.86,20.46 J2204.9
!SPS_POWER_PRESENT!  (via drill 0.2)
  Top 0.254: U2100.10 39.49,56.27 v39.24,56.52 | v30.48,52.32 30.41,52.25 | v30.48,52.32 R2102.1 | Q2100.4 30.28,51.36 30.48,51.56 v30.48,52.32
  Bottom 0.254: v39.24,56.52 39.12,56.64 36.32,56.64 32,52.32 v30.48,52.32 30.48,49.53 32.52,47.49 U2102.7
!TRST!
  Top 0.254: U2200.#TRST 13.26,26.85 8.12,21.71 J2204.7
A_3P3  (via drill 0.2)
  Top 0.254: U2200.VDDA 18.01,23.85 18.8,24.64 18.8,24.77 v19.81,25.78
  Bottom 0.254: v19.81,25.78 19.3,25.78 18.92,25.4 18.92,23.24 19.18,22.99 19.94,22.99 21.08,21.84 22.95,21.84 R2217.1 JP2203.2 23.08,20.45 25.53,20.45 26.16,21.08 45.59,21.08 TP-AVCC.PAD
A_GND  (via drill 0.2)
  Top 0.254: U2200.VSSA 18.14,23.35 19.56,24.77 v19.81,24.77
  Bottom 0.254: v19.81,24.77 20.32,24.77 20.7,25.15 21.37,25.15 C2213.1 29.59,25.06 | TP-VREF-GND.PAD 49.91,27.94 48.77,27.94 44.96,24.13 30.61,24.13 29.68,25.06 29.59,25.06 | 29.59,25.06 JP2204.2
AUX_1.2
  Top 0.762: J2000.AUX_1@12 J2000.AUX_1@11
  Bottom 0.254: J2000.AUX_1@12 5.18,36.48 5.84,35.81 5.84,32 6.83,32 TVS2201.4 5.84,31.91 5.84,27.56 | R2212.1 1.27,25.02 3.81,27.56 5.84,27.56 | 5.84,27.56 TP-AUX1.PAD
AUX_2.2
  Top 0.762: J2000.AUX_2@13 J2000.AUX_2@14
  Route15 0.254: TP-AUX2.PAD 10.16,32.77 7.7,35.23 J2000.AUX_2@13
  Bottom 0.254: R2211.1 2.67,25.65 3.68,26.8 9.27,26.8 TP-AUX2.PAD | TVS2201.6 8.82,33.34 7.24,34.92 7.11,34.92 J2000.AUX_2@13
B+
  pour Top (no thermals): 7.62,40.39 7.62,42.16 4.06,42.16 4.06,43.43 10.41,43.43 10.67,43.18 10.67,42.16 8.89,40.39
B-
  pour Top (isolate 0.254, no thermals): 7.37,36.32 7.37,34.54 4.06,34.54 4.06,33.27 10.67,33.27 10.67,34.54 8.89,36.32
BATTERY_CHARGE
  Top 0.254: B2100.1 35.81,58.67 36.45,58.17 36.45,54.1 36.71,53.85 U2100.14
  Top 1.016: Q2101.5-6-7-8 33.02,56.88 B2100.1
BATTERY_CONNECT_CONTROL  (via drill 0.2)
  Top 0.254: Q2101.4 34.47,54.18 v35.05,53.59 | U2100.13 37.99,54.47 v37.47,54.86
  Bottom 0.254: v37.47,54.86 36.07,53.59 v35.05,53.59
BIAS_VOLTS_FOR_NTC_THERMISTOR
  Top 0.254: U2100.9 39.99,54.97 40.39,55.37 41.87,55.37 R2103.1
BIN
  Top 0.254: L2000.3 13.34,43.02
  pour Top (isolate 0.254, no thermals): 14.99,40.89 12.7,43.43 12.7,45.72 15.24,45.72 15.24,40.89
CAN1_H
  Top 0.762: J2000.CAN_H@4 J2000.CAN_H@3
  Bottom 0.254: 7.79,47.37 U2201.7 | 7.79,47.37 R2200.2 | 7.79,47.37 5.71,47.37 4.95,46.61 4.95,44.2 3.81,43.05 3.81,42.47 J2000.CAN_H@4
CAN1_L
  Top 0.762: J2000.CAN_L@6 J2000.CAN_L@5
  Bottom 0.254: U2201.6 7.79,46.1 R2200.1 7.62,45.21 5.84,43.43 5.84,40.64 6.25,40.23 J2000.CAN_L@5
CAN_DISCONNECT
  Bottom 0.254: U2201.5 11.68,44.83 12.32,45.47 15.33,45.47 D2202.K 16.17,44.7 17.14,44.7 17.78,45.34 20.45,45.34 27.05,38.73 R2203.2 27.1,35.14 D2201.K
CHARGE_TIMER
  Top 0.254: U2100.6 39.99,50.18 40.13,50.04 41.66,50.04 42.16,50.55 42.16,52.29 C2100.2
CHASSIS
  Bottom 0.406: J2000.CHASSIS@1 2.79,45.46 2.79,42.16 3.56,41.4 3.56,38.86 | 3.56,37.59 3.56,35.31 2.79,34.54 2.79,31.24 J2000.CHASSIS@2 | 3.56,37.59 3.56,38.86 | R2000.1 3.34,39.08 3.56,38.86 | 3.56,37.59 C2000.1
CPU_VREF  (via drill 0.2)
  Top 0.254: U2200.VREF 18.28,22.85 19.18,23.75 v19.81,23.75
  Bottom 0.254: v19.81,23.75 20.32,23.75 20.7,23.37 21.37,23.37 C2213.2 22.94,23.46 R2217.2 R2216.2
CPU_XTAL1  (via drill 0.2)
  Top 0.254: U2200.XTAL1 18.49,17.85 v18.54,18.03
  Bottom 0.254: v18.54,18.03 18.54,19.35 18.3,19.52 | 18.3,19.52 X2201.P$1 | C2208.2 20.54,19.94 18.54,19.94 18.3,19.7 18.3,19.52
CPU_XTAL2  (via drill 0.2)
  Top 0.254: U2200.XTAL2 18.34,17.35 v18.54,17.14
  Bottom 0.254: 18.54,15.37 18.54,15.26 X2201.P$2 17.52,14.63 | 18.54,15.37 v18.54,17.14 | C2209.2 20.54,15.37 18.54,15.37 | 17.52,14.63 17.44,14.54 | C2220.1 17.27,14.73 17.41,14.73 17.52,14.63
DEBUG.13
  Bottom 0.254: J2204.13 6.32,17.94 7.62,16.64 TP-DBG13.PAD
DEBUG.14
  Bottom 0.254: J2204.14 3.05,16.69 TP-DBG14.PAD
DEBUG.15
  Bottom 0.254: J2204.15 6.32,15.72 TP-DBG15.PAD
DOMINANT_BIT_STUCK_WHEN_HIGH
  Bottom 0.254: U2202.3 18.16,39.75 18.41,39.5 19.68,39.5 20.32,40.13 R2202.1 21.67,39.97 D2200.A 21.84,39.5 22.64,38.7 C2200.2
EXT_VREF
  Bottom 0.254: R2216.1 44.92,21.81 48.01,24.89 52.7,24.89 TP-VREF.PAD
FB
  Top 0.254: U2101.FB 33.44,43.02
  pour Top (isolate 0.254, rank 2, no thermals): 31.75,37.85 31.75,41.02 33.66,41.02 33.66,43.05 33.02,43.05 33.02,41.4 30.48,41.4 30.48,37.85
GND  (via drill 0.2, 0.81)
  Top 0.254: U2101.PGND@3 U2101.PGND 37.21,44.07 | 13.59,34.29 13.97,34.29 | 14.22,34.8 13.97,35.05 | 34.54,43.57 U2101.GND 32.01,43.57 31.88,43.43 31.88,43.34 R2110.1 | 34.54,43.57 34.54,43.56 | 34.54,43.57 34.54,43.81 U2101.PGND@2 | C2101.1 34.55,46.85
  Bottom 0.254: JP2201.2 v15.49,38.35
  other vias: 14.99,33.53 12.45,33.53 19.81,50.55 2.54,40.51 2.54,36.45 15.88,36.7 6.22,44.96 15.49,34.04 21.84,51.18 21.84,50.55 17.91,50.8 17.91,50.04 21.84,49.91 17.27,50.42 31.5,26.92 27.56,28.83 20.57,28.83 18.54,21.21 21.59,13.08 26.54,15.88 31.5,18.41 20.57,28.07 27.56,28.07 30.73,26.92 30.73,18.41 26.54,16.64 21.59,12.32 19.3,21.21 19.43,17.65 21.72,17.65 14.35,20.32 15.62,7.37 14.99,6.6 9.14,14.99 0.89,0.89 38.73,48.9 38.99,52.2 36.07,52.07 0.89,60.07 34.8,44.07 58.67,1.14 61.21,1.14 63.75,1.14 66.29,1.14 68.83,1.14 71.37,1.14 73.91,1.14 76.45,1.14 78.99,1.14 81.53,1.14 84.07,1.14 86.61,1.14 89.15,1.14 91.69,1.14 94.23,1.14 96.77,1.14 99.31,1.14 58.67,59.56 61.21,59.56 63.75,59.56 66.29,59.56 68.83,59.56 71.37,59.56 73.91,59.56 76.45,59.56 78.99,59.56 81.53,59.56 84.07,59.56 86.61,59.56 89.15,59.56 91.69,59.56 94.23,59.56 96.77,59.56 99.31,59.56 9.02,8.64 27.56,11.43 26.29,23.37 18.67,26.29 26.42,19.3 28.57,22.73 38.35,19.56 13.59,0.89 26.29,0.89 38.1,0.89 0.89,12.95 0.89,27.94 0.89,54.36 21.84,42.8 27.69,39.75 27.43,44.2 26.92,47.37 26.92,46.61 40.26,39.75 41.91,41.15 46.74,44.58 48.01,47.24 43.31,51.18 9.65,60.07 28.19,60.07 40.13,60.07 9.65,25.78 52.32,26.54 52.32,1.14 52.32,13.84 52.32,39.24 100.71,17.65 100.71,30.35 100.71,43.05 62.48,17.65 62.48,30.35 62.48,43.05 75.18,17.65 75.18,30.35 75.18,43.05 87.88,17.65 87.88,30.35 87.88,43.05 38.48,44.7 44.07,19.56 10.29,60.07 10.92,60.07 6.73,57.15 1.52,58.42 6.22,46.48 1.52,48.01 25.02,45.85 25.65,45.85 26.29,45.85 26.92,45.97 29.59,23.88 18.8,3.81 16.89,5.97 13.59,39.88 13.59,36.7 16.89,40.77 11.05,11.81 11.05,19.56
  pour Bottom (isolate 0.254, rank 4): 101.6,0 0,0 0,60.96 101.6,60.96
  pour Top (isolate 0.254, rank 4): 0,0 0,60.96 101.6,60.96 101.6,0
  pour Route2 (isolate 0.254, rank 4): 0,60.96 101.6,60.96 101.6,0 0,0
  pour Route2 (no thermals): 30.99,59.69 33.78,59.69 33.78,59.18 33.78,57.66 30.99,57.66
  pour Top (isolate 0.254, no thermals): 13.72,60.96 16,60.96 16,51.82 14.73,51.82 14.73,52.45 13.72,52.45
  pour Top (isolate 0.254, no thermals): 34.04,42.42 34.04,38.35 35.31,38.35 35.31,42.42
  pour Top (isolate 0.254, no thermals): 35.18,45.72 35.18,47.75 33.78,47.75 33.78,47.37 32.51,47.37 32.51,45.72
HAP_OUT  (via drill 0.2, 0.81)
  Top 0.254: C2104.2 32.8,37.94 33.15,37.59 35.94,37.59 36.45,38.1 36.45,39.1 C2108.2
  Top 0.508: C2104.2 R2109.2
  Route15 0.254: v37.72,42.04 v37.72,41.27 | v38.35,38.99 38.23,38.99 38.1,39.12
  Route15 1.016: v56.13,51.94 56.26,51.94
  Route15 1.524: v56.13,51.94 v53.59,51.94 v51.05,51.94 v48.51,51.94 45.85,49.28 45.85,47.75 41.66,43.56 39.12,43.56 38.1,42.55 38.1,39.12
  other vias: 37.72,38.99 37.72,40.51 38.35,39.75 37.72,39.75 38.35,40.51 38.35,41.27 38.35,42.04
  pour Top (isolate 0.254, no thermals): 35.94,38.48 38.86,38.48 38.86,42.42 37.34,42.42 37.34,43.18 35.94,43.18
  pour Bottom (rank 2): 38.86,42.29 38.86,38.73 33.15,38.73 33.15,42.29
IN+
  Bottom 0.254: R2005.1 14.99,55.63 14.7,55.91 U2001.3 13.9,57.5 C2004.1 | C2004.1 R2006.2 | C2004.1 14.02,57.62
IN_CURRENT_LIMIT_PROG  (via drill 0.2)
  Top 0.254: U2100.3 38.49,49.92 v38.35,49.78
  Bottom 0.254: v38.35,49.78 38.48,49.91 38.48,49.78 41.4,49.78 42.16,50.55 42.16,52.29 R2101.1
INV-INV  (via drill 0.2)
  Top 0.254: v19.18,41.27 18.16,42.29 v17.65,42.29
  Bottom 0.254: U2202.5 17.66,42.3 v17.65,42.29 | U2202.1 19.16,41.14 v19.18,41.27
IO_3P3
  Bottom 0.254: U2201.3 16.09,46.1 C2201.1 16.29,45.97 16.51,45.97 16.55,45.94 16.84,46.23 JP2200.1
IO_GND  (via drill 0.2)
  Top 0.508: v9.65,38.35 11.56,36.45 v11.56,33.91
  Bottom 0.508: TVS2200.5 v9.65,38.35 TVS2200.2 JP2201.1 | TVS2201.2 7.87,30.48 | 7.87,30.48 TVS2201.5 | v11.56,33.91 10.79,33.91 9.91,33.02 9.91,30.73 9.65,30.48 7.87,30.48
L_IN
  Top 0.254: U2101.L1 36.7,44.57 37.08,44.83 | 38.1,45.97 39.24,45.97 L2100.1
  Top 0.508: 37.08,44.83 37.34,45.09
  Top 0.762: 37.34,45.09 37.72,45.59
  Top 1.016: 37.72,45.59 38.1,45.97
L_OUT
  Top 0.254: U2101.L2 37.08,43.57 37.08,43.56 37.08,43.31
  Top 0.508: 37.08,43.31 37.34,43.31
  Top 0.762: 37.34,43.31 L2100.2
  Top 1.27: L2100.2 41.28,43.3 41.91,42.67 42.89,42.67 D2100.A
MAX_UVLO  (via drill 0.2)
  Top 0.254: R2001.1 R2002.2 4.06,59.4 4.06,58.67 v4.57,58.17
  Bottom 0.254: Q2000.3 4.09,57.4 | 4.09,57.4 4.09,57.88 v4.57,58.17 | U2000.6 4.16,57.34 4.09,57.4
N$2
  Bottom 0.254: U2202.2 18.66,40.77 18.29,41.15 18.29,41.27 18.92,41.91 19.43,41.91 19.81,41.53 20.28,41.53 R2202.2 21.67,41.57 D2200.K
N$3
  Top 0.254: U2002.VC 20.31,48.52 20.83,48.01 R2008.2
N$4
  Top 0.254: U2002.RT 21.52,49.13 R2009.2
N$5
  Top 0.254: R2008.1 21.04,45.47 21.17,45.34 C2008.2
N$6
  Bottom 0.254: U2202.7 18.66,42.41 17.78,41.53 16.76,41.53 16.13,42.16 D2202.A
N$7
  Top 0.254: R2105.2 35.05,52.07 35.81,52.83 35.81,54.1 35.56,54.36 LED2100.A
N$8  (via drill 0.81)
  other vias: 58.67,6.22
N$9  (via drill 0.81)
  other vias: 58.67,8.76
N$10
  Top 0.254: R2104.2 J2100.1
  Bottom 0.254: J2100.1 43.43,57.15 43.43,58.93 43.32,58.93 RT2100.1
N$11  (via drill 0.81)
  other vias: 58.67,11.3
N$12  (via drill 0.81)
  other vias: 58.67,13.84
N$13  (via drill 0.81)
  other vias: 58.67,16.38
N$14  (via drill 0.81)
  other vias: 58.67,18.92
N$15  (via drill 0.81)
  other vias: 58.67,21.46
N$16  (via drill 0.81)
  other vias: 58.67,24
N$17  (via drill 0.81)
  other vias: 58.67,26.54
N$18  (via drill 0.81)
  other vias: 58.67,29.08
N$19  (via drill 0.81)
  other vias: 58.67,31.62
N$20  (via drill 0.81)
  other vias: 58.67,34.16
N$21  (via drill 0.81)
  other vias: 58.67,36.7
N$22  (via drill 0.81)
  other vias: 58.67,39.24
N$23  (via drill 0.81)
  other vias: 58.67,41.78
N$24  (via drill 0.81)
  other vias: 58.67,44.32
N$25  (via drill 0.81)
  other vias: 58.67,46.86
N$26  (via drill 0.81)
  other vias: 58.67,49.4
N$27  (via drill 0.81)
  other vias: 58.67,51.94
N$28  (via drill 0.81)
  other vias: 58.67,54.48
N$29  (via drill 0.81)
  other vias: 61.21,6.22
N$30  (via drill 0.81)
  other vias: 61.21,8.76
N$31  (via drill 0.81)
  other vias: 61.21,11.3
N$32  (via drill 0.81)
  other vias: 61.21,13.84
N$33  (via drill 0.81)
  other vias: 61.21,16.38
N$34  (via drill 0.81)
  other vias: 61.21,18.92
N$35  (via drill 0.81)
  other vias: 61.21,21.46
N$36  (via drill 0.81)
  other vias: 61.21,24
N$37  (via drill 0.81)
  other vias: 61.21,26.54
N$38  (via drill 0.81)
  other vias: 61.21,29.08
N$39  (via drill 0.81)
  other vias: 61.21,31.62
N$40  (via drill 0.81)
  other vias: 61.21,34.16
N$41  (via drill 0.81)
  other vias: 61.21,36.7
N$42  (via drill 0.81)
  other vias: 61.21,39.24
N$43  (via drill 0.81)
  other vias: 61.21,41.78
N$44  (via drill 0.81)
  other vias: 61.21,44.32
N$45  (via drill 0.81)
  other vias: 61.21,46.86
N$46  (via drill 0.81)
  other vias: 61.21,49.4
N$47  (via drill 0.81)
  other vias: 61.21,51.94
N$48  (via drill 0.81)
  other vias: 61.21,54.48
N$49  (via drill 0.81)
  other vias: 63.75,6.22
N$50  (via drill 0.81)
  other vias: 63.75,8.76
N$51  (via drill 0.81)
  other vias: 63.75,11.3
N$52  (via drill 0.81)
  other vias: 63.75,13.84
N$53  (via drill 0.81)
  other vias: 63.75,16.38
N$54  (via drill 0.81)
  other vias: 63.75,18.92
N$55  (via drill 0.81)
  other vias: 63.75,21.46
N$56  (via drill 0.81)
  other vias: 63.75,24
N$57  (via drill 0.81)
  other vias: 63.75,26.54
N$58  (via drill 0.81)
  other vias: 63.75,29.08
N$59  (via drill 0.81)
  other vias: 63.75,31.62
N$60  (via drill 0.81)
  other vias: 63.75,34.16
N$61  (via drill 0.81)
  other vias: 63.75,36.7
N$62  (via drill 0.81)
  other vias: 63.75,39.24
N$63  (via drill 0.81)
  other vias: 63.75,41.78
N$64  (via drill 0.81)
  other vias: 63.75,44.32
N$65  (via drill 0.81)
  other vias: 63.75,46.86
N$66  (via drill 0.81)
  other vias: 63.75,49.4
N$67  (via drill 0.81)
  other vias: 63.75,51.94
N$68  (via drill 0.81)
  other vias: 63.75,54.48
N$69  (via drill 0.81)
  other vias: 66.29,6.22
N$70  (via drill 0.81)
  other vias: 66.29,8.76
N$71  (via drill 0.81)
  other vias: 66.29,11.3
N$72  (via drill 0.81)
  other vias: 66.29,13.84
N$73  (via drill 0.81)
  other vias: 66.29,16.38
N$74  (via drill 0.81)
  other vias: 66.29,18.92
N$75  (via drill 0.81)
  other vias: 66.29,21.46
N$76  (via drill 0.81)
  other vias: 66.29,24
N$77  (via drill 0.81)
  other vias: 66.29,26.54
N$78  (via drill 0.81)
  other vias: 66.29,29.08
N$79  (via drill 0.81)
  other vias: 66.29,31.62
N$80  (via drill 0.81)
  other vias: 66.29,34.16
N$81  (via drill 0.81)
  other vias: 66.29,36.7
N$82  (via drill 0.81)
  other vias: 66.29,39.24
N$83  (via drill 0.81)
  other vias: 66.29,41.78
N$84  (via drill 0.81)
  other vias: 66.29,44.32
N$85  (via drill 0.81)
  other vias: 66.29,46.86
N$86  (via drill 0.81)
  other vias: 66.29,49.4
N$87  (via drill 0.81)
  other vias: 66.29,51.94
N$88  (via drill 0.81)
  other vias: 66.29,54.48
N$89  (via drill 0.81)
  other vias: 68.83,6.22
N$90  (via drill 0.81)
  other vias: 68.83,8.76
N$91  (via drill 0.81)
  other vias: 68.83,11.3
N$92  (via drill 0.81)
  other vias: 68.83,13.84
N$93  (via drill 0.81)
  other vias: 68.83,16.38
N$94  (via drill 0.81)
  other vias: 68.83,18.92
N$95  (via drill 0.81)
  other vias: 68.83,21.46
N$96  (via drill 0.81)
  other vias: 68.83,24
N$97  (via drill 0.81)
  other vias: 68.83,26.54
N$98  (via drill 0.81)
  other vias: 68.83,29.08
N$99  (via drill 0.81)
  other vias: 68.83,31.62
N$100  (via drill 0.81)
  other vias: 68.83,34.16
N$101  (via drill 0.81)
  other vias: 68.83,36.7
N$102  (via drill 0.81)
  other vias: 68.83,39.24
N$103  (via drill 0.81)
  other vias: 68.83,41.78
N$104  (via drill 0.81)
  other vias: 68.83,44.32
N$105  (via drill 0.81)
  other vias: 68.83,46.86
N$106  (via drill 0.81)
  other vias: 68.83,49.4
N$107  (via drill 0.81)
  other vias: 68.83,51.94
N$108  (via drill 0.81)
  other vias: 68.83,54.48
N$109  (via drill 0.81)
  other vias: 71.37,6.22
N$110  (via drill 0.81)
  other vias: 71.37,8.76
N$111  (via drill 0.81)
  other vias: 71.37,11.3
N$112  (via drill 0.81)
  other vias: 71.37,13.84
N$113  (via drill 0.81)
  other vias: 71.37,16.38
N$114  (via drill 0.81)
  other vias: 71.37,18.92
N$115  (via drill 0.81)
  other vias: 71.37,21.46
N$116  (via drill 0.81)
  other vias: 71.37,24
N$117  (via drill 0.81)
  other vias: 71.37,26.54
N$118  (via drill 0.81)
  other vias: 71.37,29.08
N$119  (via drill 0.81)
  other vias: 71.37,31.62
N$120  (via drill 0.81)
  other vias: 71.37,34.16
N$121  (via drill 0.81)
  other vias: 71.37,36.7
N$122  (via drill 0.81)
  other vias: 71.37,39.24
N$123  (via drill 0.81)
  other vias: 71.37,41.78
N$124  (via drill 0.81)
  other vias: 71.37,44.32
N$125  (via drill 0.81)
  other vias: 71.37,46.86
N$126  (via drill 0.81)
  other vias: 71.37,49.4
N$127  (via drill 0.81)
  other vias: 71.37,51.94
N$128  (via drill 0.81)
  other vias: 71.37,54.48
N$129  (via drill 0.81)
  other vias: 73.91,6.22
N$130  (via drill 0.81)
  other vias: 73.91,8.76
N$131  (via drill 0.81)
  other vias: 73.91,11.3
N$132  (via drill 0.81)
  other vias: 73.91,13.84
N$133  (via drill 0.81)
  other vias: 73.91,16.38
N$134  (via drill 0.81)
  other vias: 73.91,18.92
N$135  (via drill 0.81)
  other vias: 73.91,21.46
N$136  (via drill 0.81)
  other vias: 73.91,24
N$137  (via drill 0.81)
  other vias: 73.91,26.54
N$138  (via drill 0.81)
  other vias: 73.91,29.08
N$139  (via drill 0.81)
  other vias: 73.91,31.62
N$140  (via drill 0.81)
  other vias: 73.91,34.16
N$141  (via drill 0.81)
  other vias: 73.91,36.7
N$142  (via drill 0.81)
  other vias: 73.91,39.24
N$143  (via drill 0.81)
  other vias: 73.91,41.78
N$144  (via drill 0.81)
  other vias: 73.91,44.32
N$145  (via drill 0.81)
  other vias: 73.91,46.86
N$146  (via drill 0.81)
  other vias: 73.91,49.4
N$147  (via drill 0.81)
  other vias: 73.91,51.94
N$148  (via drill 0.81)
  other vias: 73.91,54.48
N$149  (via drill 0.81)
  other vias: 76.45,6.22
N$150  (via drill 0.81)
  other vias: 76.45,8.76
N$151  (via drill 0.81)
  other vias: 76.45,11.3
N$152  (via drill 0.81)
  other vias: 76.45,13.84
N$153  (via drill 0.81)
  other vias: 76.45,16.38
N$154  (via drill 0.81)
  other vias: 76.45,18.92
N$155  (via drill 0.81)
  other vias: 76.45,21.46
N$156  (via drill 0.81)
  other vias: 76.45,24
N$157  (via drill 0.81)
  other vias: 76.45,26.54
N$158  (via drill 0.81)
  other vias: 76.45,29.08
N$159  (via drill 0.81)
  other vias: 76.45,31.62
N$160  (via drill 0.81)
  other vias: 76.45,34.16
N$161  (via drill 0.81)
  other vias: 76.45,36.7
N$162  (via drill 0.81)
  other vias: 76.45,39.24
N$163  (via drill 0.81)
  other vias: 76.45,41.78
N$164  (via drill 0.81)
  other vias: 76.45,44.32
N$165  (via drill 0.81)
  other vias: 76.45,46.86
N$166  (via drill 0.81)
  other vias: 76.45,49.4
N$167  (via drill 0.81)
  other vias: 76.45,51.94
N$168  (via drill 0.81)
  other vias: 76.45,54.48
N$169  (via drill 0.81)
  other vias: 78.99,6.22
N$170  (via drill 0.81)
  other vias: 78.99,8.76
N$171  (via drill 0.81)
  other vias: 78.99,11.3
N$172  (via drill 0.81)
  other vias: 78.99,13.84
N$173  (via drill 0.81)
  other vias: 78.99,16.38
N$174  (via drill 0.81)
  other vias: 78.99,18.92
N$175  (via drill 0.81)
  other vias: 78.99,21.46
N$176  (via drill 0.81)
  other vias: 78.99,24
N$177  (via drill 0.81)
  other vias: 78.99,26.54
N$178  (via drill 0.81)
  other vias: 78.99,29.08
N$179  (via drill 0.81)
  other vias: 78.99,31.62
N$180  (via drill 0.81)
  other vias: 78.99,34.16
N$181  (via drill 0.81)
  other vias: 78.99,36.7
N$182  (via drill 0.81)
  other vias: 78.99,39.24
N$183  (via drill 0.81)
  other vias: 78.99,41.78
N$184  (via drill 0.81)
  other vias: 78.99,44.32
N$185  (via drill 0.81)
  other vias: 78.99,46.86
N$186  (via drill 0.81)
  other vias: 78.99,49.4
N$187  (via drill 0.81)
  other vias: 78.99,51.94
N$188  (via drill 0.81)
  other vias: 78.99,54.48
N$189  (via drill 0.81)
  other vias: 81.53,6.22
N$190  (via drill 0.81)
  other vias: 81.53,8.76
N$191  (via drill 0.81)
  other vias: 81.53,11.3
N$192  (via drill 0.81)
  other vias: 81.53,13.84
N$193  (via drill 0.81)
  other vias: 81.53,16.38
N$194  (via drill 0.81)
  other vias: 81.53,18.92
N$195  (via drill 0.81)
  other vias: 81.53,21.46
N$196  (via drill 0.81)
  other vias: 81.53,24
N$197  (via drill 0.81)
  other vias: 81.53,26.54
N$198  (via drill 0.81)
  other vias: 81.53,29.08
N$199  (via drill 0.81)
  other vias: 81.53,31.62
N$200  (via drill 0.81)
  other vias: 81.53,34.16
N$201  (via drill 0.81)
  other vias: 81.53,36.7
N$202  (via drill 0.81)
  other vias: 81.53,39.24
N$203  (via drill 0.81)
  other vias: 81.53,41.78
N$204  (via drill 0.81)
  other vias: 81.53,44.32
N$205  (via drill 0.81)
  other vias: 81.53,46.86
N$206  (via drill 0.81)
  other vias: 81.53,49.4
N$207  (via drill 0.81)
  other vias: 81.53,51.94
N$208  (via drill 0.81)
  other vias: 81.53,54.48
N$209  (via drill 0.81)
  other vias: 84.07,6.22
N$210  (via drill 0.81)
  other vias: 84.07,8.76
N$211  (via drill 0.81)
  other vias: 84.07,11.3
N$212  (via drill 0.81)
  other vias: 84.07,13.84
N$213  (via drill 0.81)
  other vias: 84.07,16.38
N$214  (via drill 0.81)
  other vias: 84.07,18.92
N$215  (via drill 0.81)
  other vias: 84.07,21.46
N$216  (via drill 0.81)
  other vias: 84.07,24
N$217  (via drill 0.81)
  other vias: 84.07,26.54
N$218  (via drill 0.81)
  other vias: 84.07,29.08
N$219  (via drill 0.81)
  other vias: 84.07,31.62
N$220  (via drill 0.81)
  other vias: 84.07,34.16
N$221  (via drill 0.81)
  other vias: 84.07,36.7
N$222  (via drill 0.81)
  other vias: 84.07,39.24
N$223  (via drill 0.81)
  other vias: 84.07,41.78
N$224  (via drill 0.81)
  other vias: 84.07,44.32
N$225  (via drill 0.81)
  other vias: 84.07,46.86
N$226  (via drill 0.81)
  other vias: 84.07,49.4
N$227  (via drill 0.81)
  other vias: 84.07,51.94
N$228  (via drill 0.81)
  other vias: 84.07,54.48
N$229  (via drill 0.81)
  other vias: 86.61,6.22
N$230  (via drill 0.81)
  other vias: 86.61,8.76
N$231  (via drill 0.81)
  other vias: 86.61,11.3
N$232  (via drill 0.81)
  other vias: 86.61,13.84
N$233  (via drill 0.81)
  other vias: 86.61,16.38
N$234  (via drill 0.81)
  other vias: 86.61,18.92
N$235  (via drill 0.81)
  other vias: 86.61,21.46
N$236  (via drill 0.81)
  other vias: 86.61,24
N$237  (via drill 0.81)
  other vias: 86.61,26.54
N$238  (via drill 0.81)
  other vias: 86.61,29.08
N$239  (via drill 0.81)
  other vias: 86.61,31.62
N$240  (via drill 0.81)
  other vias: 86.61,34.16
N$241  (via drill 0.81)
  other vias: 86.61,36.7
N$242  (via drill 0.81)
  other vias: 86.61,39.24
N$243  (via drill 0.81)
  other vias: 86.61,41.78
N$244  (via drill 0.81)
  other vias: 86.61,44.32
N$245  (via drill 0.81)
  other vias: 86.61,46.86
N$246  (via drill 0.81)
  other vias: 86.61,49.4
N$247  (via drill 0.81)
  other vias: 86.61,51.94
N$248  (via drill 0.81)
  other vias: 86.61,54.48
N$249  (via drill 0.81)
  other vias: 89.15,6.22
N$250  (via drill 0.81)
  other vias: 89.15,8.76
N$251  (via drill 0.81)
  other vias: 89.15,11.3
N$252  (via drill 0.81)
  other vias: 89.15,13.84
N$253  (via drill 0.81)
  other vias: 89.15,16.38
N$254  (via drill 0.81)
  other vias: 89.15,18.92
N$255  (via drill 0.81)
  other vias: 89.15,21.46
N$256  (via drill 0.81)
  other vias: 89.15,24
N$257  (via drill 0.81)
  other vias: 89.15,26.54
N$258  (via drill 0.81)
  other vias: 89.15,29.08
N$259  (via drill 0.81)
  other vias: 89.15,31.62
N$260  (via drill 0.81)
  other vias: 89.15,34.16
N$261  (via drill 0.81)
  other vias: 89.15,36.7
N$262  (via drill 0.81)
  other vias: 89.15,39.24
N$263  (via drill 0.81)
  other vias: 89.15,41.78
N$264  (via drill 0.81)
  other vias: 89.15,44.32
N$265  (via drill 0.81)
  other vias: 89.15,46.86
N$266  (via drill 0.81)
  other vias: 89.15,49.4
N$267  (via drill 0.81)
  other vias: 89.15,51.94
N$268  (via drill 0.81)
  other vias: 89.15,54.48
N$269  (via drill 0.81)
  other vias: 91.69,6.22
N$270  (via drill 0.81)
  other vias: 91.69,8.76
N$271  (via drill 0.81)
  other vias: 91.69,11.3
N$272  (via drill 0.81)
  other vias: 91.69,13.84
N$273  (via drill 0.81)
  other vias: 91.69,16.38
N$274  (via drill 0.81)
  other vias: 91.69,18.92
N$275  (via drill 0.81)
  other vias: 91.69,21.46
N$276  (via drill 0.81)
  other vias: 91.69,24
N$277  (via drill 0.81)
  other vias: 91.69,26.54
N$278  (via drill 0.81)
  other vias: 91.69,29.08
N$279  (via drill 0.81)
  other vias: 91.69,31.62
N$280  (via drill 0.81)
  other vias: 91.69,34.16
N$281  (via drill 0.81)
  other vias: 91.69,36.7
N$282  (via drill 0.81)
  other vias: 91.69,39.24
N$283  (via drill 0.81)
  other vias: 91.69,41.78
N$284  (via drill 0.81)
  other vias: 91.69,44.32
N$285  (via drill 0.81)
  other vias: 91.69,46.86
N$286  (via drill 0.81)
  other vias: 91.69,49.4
N$287  (via drill 0.81)
  other vias: 91.69,51.94
N$288  (via drill 0.81)
  other vias: 91.69,54.48
N$289  (via drill 0.81)
  other vias: 99.31,6.22
N$290  (via drill 0.81)
  other vias: 94.23,16.38
N$291  (via drill 0.81)
  other vias: 94.23,18.92
N$292  (via drill 0.81)
  other vias: 94.23,21.46
N$293  (via drill 0.81)
  other vias: 94.23,24
N$294  (via drill 0.81)
  other vias: 94.23,26.54
N$295  (via drill 0.81)
  other vias: 94.23,29.08
N$296  (via drill 0.81)
  other vias: 94.23,31.62
N$297  (via drill 0.81)
  other vias: 94.23,34.16
N$298  (via drill 0.81)
  other vias: 94.23,36.7
N$299  (via drill 0.81)
  other vias: 94.23,39.24
N$300  (via drill 0.81)
  other vias: 94.23,41.78
N$301  (via drill 0.81)
  other vias: 94.23,44.32
N$302  (via drill 0.81)
  other vias: 99.31,46.86
N$303
  Top 0.254: R2205.1 8.13,6.86 6.38,5.11 LED2200.1
N$304  (via drill 0.81)
  other vias: 96.77,16.38
N$305  (via drill 0.81)
  other vias: 96.77,18.92
N$306  (via drill 0.81)
  other vias: 96.77,21.46
N$307  (via drill 0.81)
  other vias: 96.77,24
N$308  (via drill 0.81)
  other vias: 96.77,26.54
N$309  (via drill 0.81)
  other vias: 96.77,29.08
N$310  (via drill 0.81)
  other vias: 96.77,31.62
N$311  (via drill 0.81)
  other vias: 96.77,34.16
N$312  (via drill 0.81)
  other vias: 96.77,36.7
N$313  (via drill 0.81)
  other vias: 96.77,39.24
N$314  (via drill 0.81)
  other vias: 96.77,41.78
N$315  (via drill 0.81)
  other vias: 96.77,44.32
N$316
  Top 0.254: Q2200.3 LED2200.2
N$317  (via drill 0.81)
  other vias: 99.31,13.84
N$318  (via drill 0.81)
  other vias: 99.31,16.38
N$319  (via drill 0.81)
  other vias: 99.31,18.92
N$320  (via drill 0.81)
  other vias: 99.31,21.46
N$321  (via drill 0.81)
  other vias: 99.31,24
N$322  (via drill 0.81)
  other vias: 99.31,26.54
N$323  (via drill 0.81)
  other vias: 99.31,29.08
N$324  (via drill 0.81)
  other vias: 99.31,31.62
N$325  (via drill 0.81)
  other vias: 99.31,34.16
N$326  (via drill 0.81)
  other vias: 99.31,36.7
N$327  (via drill 0.81)
  other vias: 99.31,39.24
N$328  (via drill 0.81)
  other vias: 99.31,41.78
N$329  (via drill 0.81)
  other vias: 99.31,44.32
N$330  (via drill 0.81)
  other vias: 99.31,54.48
N$331
  Top 0.254: R2206.2 4.15,2.76 4.45,3.05 5.3,3.05 LED2200.3
N$332
  Top 0.254: LED2200.5 Q2201.3
N$333
  Top 0.254: R2207.2 9.56,2.76 9.27,3.05 8.42,3.05 LED2200.4
N$334
  Top 1.016: R2003.1 12.75,47.23 Q2001.5-6-7-8
N$335
  Top 0.254: U2100.5 39.49,49.92 40.01,49.4 40.51,49.4 TP1.1.PAD
N$336  (via drill 0.2)
  Top 0.254: U2100.11 38.99,55.88 v37.08,57.78 | LED2100.C v35.56,57.78
  Bottom 0.254: v35.56,57.78 v37.08,57.78 39.12,57.78 39.88,57.02 39.88,55.12 40.89,54.1 R2112.2
N$337
  Bottom 0.254: R2219.1 C2220.2 17.23,11.81 15.92,11.81 | 15.92,11.81 U2203.2 | R2218.2 15.24,12.49 15.92,11.81
N$338
  Top 0.254: 31.71,46.48 R2108.1 30.7,46.44 30.23,45.97 30.23,44.23 C2103.2 | C2103.2 30.34,44.12 | U2101.VINA 30.39,44.07 C2103.2
N_DRAIN
  Bottom 0.254: R2004.1 8.76,59.56 9.02,59.31 9.02,58.67 9.14,58.55 Q2002.3 9.78,56.9 9.27,56.39 U2000.2
N_GATE
  Bottom 0.254: Q2002.1 12.41,59.44 13.21,59.44 | 13.21,59.44 13.97,59.44 14.22,59.18 14.06,59.18 C2004.2 | U2001.1 12,56.58 12.19,56.77 12.83,56.77 13.21,57.15 13.21,59.44
NTC_INPUT_FROM_BATTERY